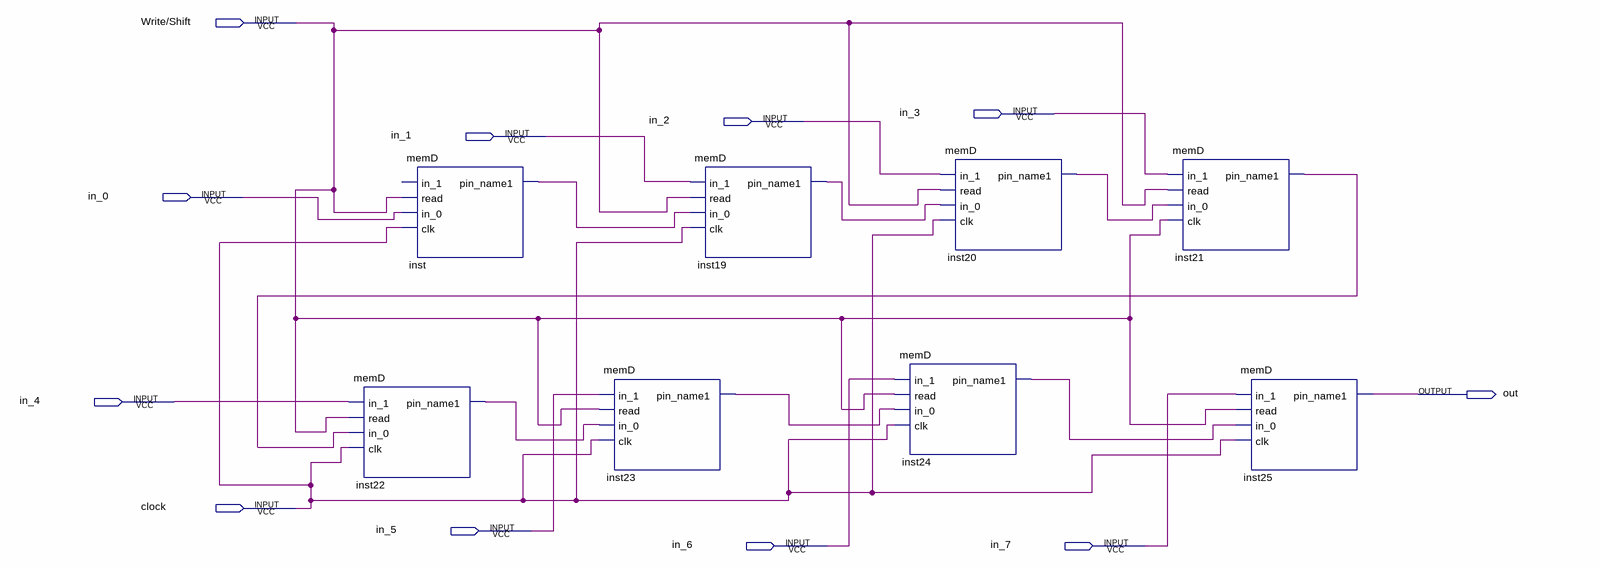
[diagram p0: schematic sheet]
// Quartus schematic shifter.bdf as structural Verilog: 8 symbols, 11 pins
module shifter (
  input  \Write/Shift ,
  input  in_3,
  input  in_2,
  input  in_1,
  input  in_0,
  input  in_4,
  input  clock,
  input  in_5,
  input  in_6,
  input  in_7,
  output out
);

  wire inst19_pin_name1, inst20_pin_name1, inst21_pin_name1, inst22_pin_name1, inst23_pin_name1,
       inst24_pin_name1, inst_pin_name1;

  memD inst22 (.in_1(in_4), .read(\Write/Shift ), .in_0(inst21_pin_name1), .clk(clock), .pin_name1(inst22_pin_name1));
  memD inst (.read(\Write/Shift ), .in_0(in_0), .clk(clock), .pin_name1(inst_pin_name1));  // open: in_1
  memD inst23 (.in_1(in_5), .read(\Write/Shift ), .in_0(inst22_pin_name1), .clk(clock), .pin_name1(inst23_pin_name1));
  memD inst19 (.in_1(in_1), .read(\Write/Shift ), .in_0(inst_pin_name1), .clk(clock), .pin_name1(inst19_pin_name1));
  memD inst24 (.in_1(in_6), .read(\Write/Shift ), .in_0(inst23_pin_name1), .clk(clock), .pin_name1(inst24_pin_name1));
  memD inst20 (.in_1(in_2), .read(\Write/Shift ), .in_0(inst19_pin_name1), .clk(clock), .pin_name1(inst20_pin_name1));
  memD inst21 (
    .in_1(in_3), .read(\Write/Shift ), .in_0(inst20_pin_name1), .clk(\Write/Shift ),
    .pin_name1(inst21_pin_name1));
  memD inst25 (.in_1(in_7), .read(\Write/Shift ), .in_0(inst24_pin_name1), .clk(clock), .pin_name1(out));
endmodule
